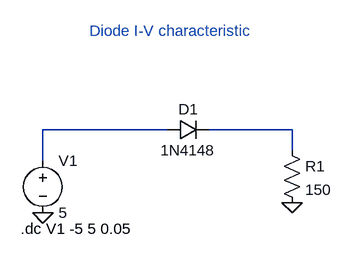
[diagram p0: schematic Diode.asc]
Diode.asc, the LTspice schematic file:
Version 4
SHEET 1 880 680
WIRE 208 208 16 208
WIRE 400 208 272 208
WIRE 400 240 400 208
WIRE 16 256 16 208
FLAG 16 336 0
FLAG 400 320 0
SYMBOL diode 208 224 R270
WINDOW 0 32 32 VTop 2
WINDOW 3 0 32 VBottom 2
SYMATTR InstName D1
SYMATTR Value 1N4148
SYMBOL voltage 16 240 R0
SYMATTR InstName V1
SYMATTR Value 5
SYMBOL res 384 224 R0
SYMATTR InstName R1
SYMATTR Value 150
TEXT 88 56 Left 2 ;Diode I-V characteristic
TEXT -18 360 Left 2 !.dc V1 -5 5 0.05

The netlist it stands for:
* Diode.asc
D1 N001 N002 1N4148
V1 N001 0 5
R1 N002 0 150
.model D D
.lib standard.dio
* Diode I-V characteristic
.dc V1 -5 5 0.05
.backanno
.end

* Results of the author's LTspice run, read from the files saved beside the schematic
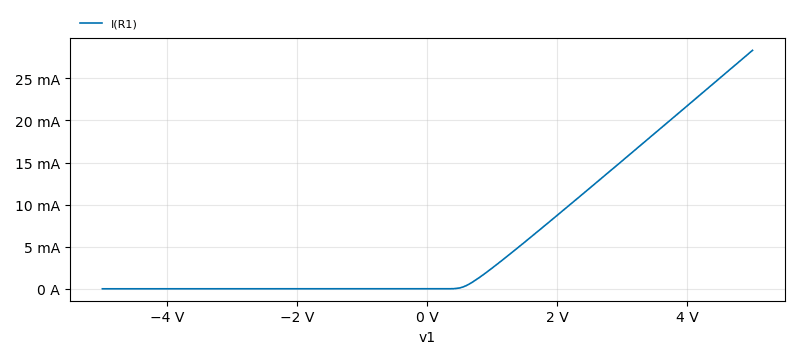
[diagram p1: DC transfer characteristic of Diode.asc, plotted from the saved traces]
* DC transfer characteristic, 1 run:
*   I(R1): -2.525 nA at v1=-5 V, 28.32 mA at v1=5 V, min -2.525 nA, max 28.32 mA